# Altium project SVN_GIT_Project.PrjPcb
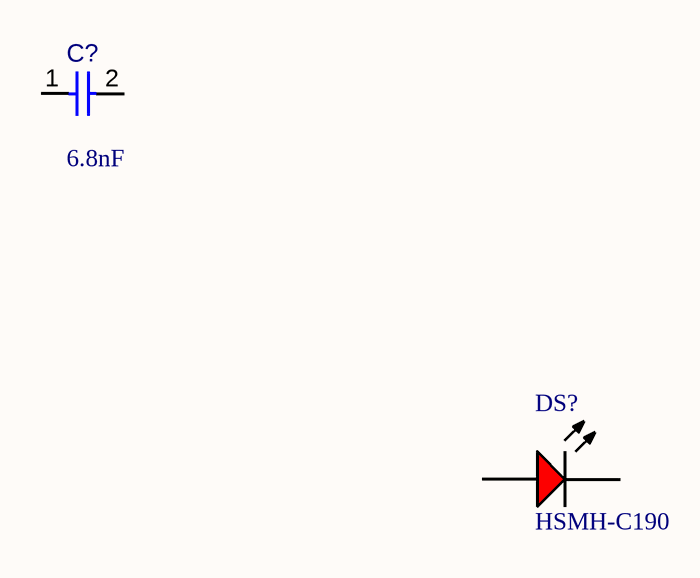
[diagram p0: Sheet1.SchDoc]
1 sheet, 2 parts. Net scope: global (net labels, ports and power ports of the same name join across sheets).
Board file: PCB1.PcbDoc

## Sheet Sheet1.SchDoc
size A3

### Parts
C?  value 6.8nF  [CAPC1005X56X25ML10T15]  (hidden comment: Capacitor 6.8 nF +/- 10% 16 V 0402)
DS?  HSMH-C190  [AVAG-HSMX-C190_V]

### Nets

Not connected (* = marked no-connect by the designer): C? 1 2; DS? 1(A) 2(K)

### Library data of the parts
C? = CMP-001-00000-4: Chip Capacitor, 6.8 nF, +/- 10%, 16 V, 0402 (1005 Metric); Capacitor Type: Ceramic; Voltage Rating: 16V; Case/Package: 0402; Pins: 2; Tolerance: 10%; Mounting Technology: SM; Min Operating Temperature: -55°C; RoHS Compliant: True; Max Operating Temperature: 125°C
DS? = CMP-007-00014-1: LED Uni-Color Red, 65 mW, 20 mA, -40 to 85 degC, 2-Pin SMD, RoHS, Tape and Reel; Manufacturer: Avago; Nominal Vf: 1.8V; Forward Current: 20mA; Luminous Intensity: 17mcd; Viewing Angle: 170degrees; Lens Style: Diffused; Power: 78mW; Packaging: TapeandReel; Colour: Red; Forward Voltage: 1.8V; Mounting Technology: SM; Case/Package: 0603; Min Operating Temperature: -40°C; Package Reference: HSMX-C190; Pins: 2; Manufacturer URL: http://www.avagotech.com/; RoHS Compliant: True; Max Operating Temperature: 85°C; Package Quantity: 4000; Illumination Colour: Red; Datasheet URL: http://docs.avagotech.com/docs/AV02-0551EN; Package Description: 2-Pin Surface Mount Device, Body 1.6 x 0.8 mm, Height 0.9 mm; Datasheet Version: Mar-12